# EAGLE design untitled (EAGLE 9.6.2)
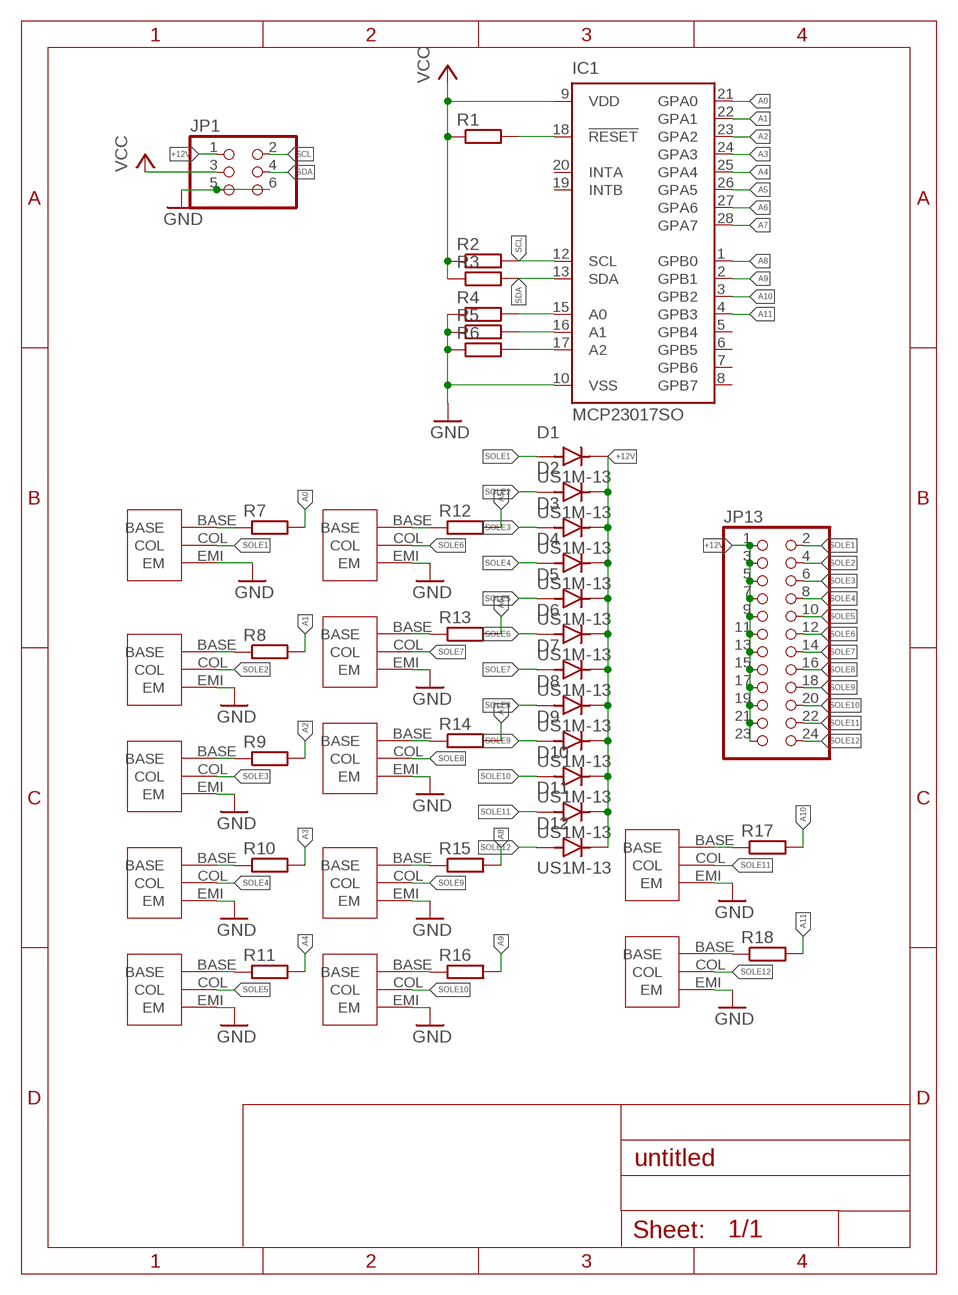
[diagram p0: schematic, sheet 1]

## Parts
BD677-SMD1  BD677-SMD  [BD677-SMD]
BD677-SMD2  BD677-SMD  [BD677-SMD]
BD677-SMD3  BD677-SMD  [BD677-SMD]
BD677-SMD4  BD677-SMD  [BD677-SMD]
BD677-SMD5  BD677-SMD  [BD677-SMD]
BD677-SMD6  BD677-SMD  [BD677-SMD]
BD677-SMD7  BD677-SMD  [BD677-SMD]
BD677-SMD8  BD677-SMD  [BD677-SMD]
BD677-SMD9  BD677-SMD  [BD677-SMD]
BD677-SMD10  BD677-SMD  [BD677-SMD]
BD677-SMD11  BD677-SMD  [BD677-SMD]
BD677-SMD12  BD677-SMD  [BD677-SMD]
D1  US1M-13  [DIOM5226X240N]
D2  US1M-13  [DIOM5226X240N]
D3  US1M-13  [DIOM5226X240N]
D4  US1M-13  [DIOM5226X240N]
D5  US1M-13  [DIOM5226X240N]
D6  US1M-13  [DIOM5226X240N]
D7  US1M-13  [DIOM5226X240N]
D8  US1M-13  [DIOM5226X240N]
D9  US1M-13  [DIOM5226X240N]
D10  US1M-13  [DIOM5226X240N]
D11  US1M-13  [DIOM5226X240N]
D12  US1M-13  [DIOM5226X240N]
IC1  MCP23017SO  [SO28W]
JP1  PINHD-2X3  [2X03]
JP13  PINHD-2X12  [2X12]
R1  R-EU_R0805  [R0805]
R2  R-EU_R0805  [R0805]
R3  R-EU_R0805  [R0805]
R4  R-EU_R0805  [R0805]
R5  R-EU_R0805  [R0805]
R6  R-EU_R0805  [R0805]
R7  R-EU_R0805  [R0805]
R8  R-EU_R0805  [R0805]
R9  R-EU_R0805  [R0805]
R10  R-EU_R0805  [R0805]
R11  R-EU_R0805  [R0805]
R12  R-EU_R0805  [R0805]
R13  R-EU_R0805  [R0805]
R14  R-EU_R0805  [R0805]
R15  R-EU_R0805  [R0805]
R16  R-EU_R0805  [R0805]
R17  R-EU_R0805  [R0805]
R18  R-EU_R0805  [R0805]

## Nets
+12V: D1.C(K) D2.C(K) D3.C(K) D4.C(K) D5.C(K) D6.C(K) D7.C(K) D8.C(K) D9.C(K) D10.C(K) D11.C(K) D12.C(K) JP1.1 JP13.1 JP13.3 JP13.5 JP13.7 JP13.9 JP13.11 JP13.13 JP13.15 JP13.17 JP13.19 JP13.21 JP13.23
A0: IC1.21(GPA0) R7.2
A1: IC1.22(GPA1) R8.2
A2: IC1.23(GPA2) R9.2
A3: IC1.24(GPA3) R10.2
A4: IC1.25(GPA4) R11.2
A5: IC1.26(GPA5) R12.2
A6: IC1.27(GPA6) R13.2
A7: IC1.28(GPA7) R14.2
A8: IC1.1(GPB0) R15.2
A9: IC1.2(GPB1) R16.2
A10: IC1.3(GPB2) R17.2
A11: IC1.4(GPB3) R18.2
GND: BD677-SMD1.EMI(EM) BD677-SMD2.EMI(EM) BD677-SMD3.EMI(EM) BD677-SMD4.EMI(EM) BD677-SMD5.EMI(EM) BD677-SMD6.EMI(EM) BD677-SMD7.EMI(EM) BD677-SMD8.EMI(EM) BD677-SMD9.EMI(EM) BD677-SMD10.EMI(EM) BD677-SMD11.EMI(EM) BD677-SMD12.EMI(EM) IC1.10(VSS) JP1.5 JP1.6 R4.1 R5.1 R6.1
N$1: IC1.18(!RESET) R1.2
N$2: BD677-SMD1.BASE R7.1
N$3: BD677-SMD2.BASE R8.1
N$4: IC1.15(A0) R4.2
N$5: IC1.16(A1) R5.2
N$6: IC1.17(A2) R6.2
N$7: BD677-SMD3.BASE R9.1
N$8: BD677-SMD6.BASE R12.1
N$9: BD677-SMD7.BASE R13.1
N$10: BD677-SMD8.BASE R14.1
N$11: BD677-SMD4.BASE R10.1
N$12: BD677-SMD5.BASE R11.1
N$13: BD677-SMD9.BASE R15.1
N$14: BD677-SMD10.BASE R16.1
N$21: BD677-SMD11.BASE R17.1
N$22: BD677-SMD12.BASE R18.1
SCL: IC1.12(SCL) JP1.2 R2.2
SDA: IC1.13(SDA) JP1.4 R3.2
SOLE1: BD677-SMD1.COL D1.A JP13.2
SOLE2: BD677-SMD2.COL D2.A JP13.4
SOLE3: BD677-SMD3.COL D3.A JP13.6
SOLE4: BD677-SMD4.COL D4.A JP13.8
SOLE5: BD677-SMD5.COL D5.A JP13.10
SOLE6: BD677-SMD6.COL D6.A JP13.12
SOLE7: BD677-SMD7.COL D7.A JP13.14
SOLE8: BD677-SMD8.COL D8.A JP13.16
SOLE9: BD677-SMD9.COL D9.A JP13.18
SOLE10: BD677-SMD10.COL D10.A JP13.20
SOLE11: BD677-SMD11.COL D11.A JP13.22
SOLE12: BD677-SMD12.COL D12.A JP13.24
VCC: IC1.9(VDD) JP1.3 R1.1 R2.1 R3.1
Unconnected: IC1.5(GPB4) IC1.6(GPB5) IC1.7(GPB6) IC1.8(GPB7) IC1.19(INTB) IC1.20(INTA)

## Library data of the parts
BD677-SMD1-BD677-SMD12 = BD677-SMD:BD677-SMD
D1-D12 = US1M-13:US1M-13: Diode, Fast Recovery, 1a, 1kv, Do-214ac-2, Full Reel Check availability <https://pricing.snapeda.com/parts/US1M-13/Diodes%20Incorporated/view-part?ref=eda>; AVAILABILITY: In Stock; DESCRIPTION: Diode Standard 1000 V 1A Surface Mount SMA; MF: Diodes Incorporated; MP: US1M-13; PACKAGE: DO-214AC-214 Diodes Incorporated; PRICE: None; PURCHASE-URL: https://pricing.snapeda.com/search/part/US1M-13/?ref=eda
IC1 = microchip:MCP23017: http://ww1.microchip.com/downloads/en/DeviceDoc/21952a.pdf Source: http://ww1.microchip.com/downloads/en/DeviceDoc/21952a.pdf; MF: MICROCHIP; MPN: MCP23017-E/SO; OC_FARNELL: 1332087; OC_NEWARK: 31K2958
JP1 = pinhead:PINHD-2X3: PIN HEADER
JP13 = pinhead:PINHD-2X12: PIN HEADER
R1-R18 = rcl:R-EU_: RESISTOR, European symbol; SPICEPREFIX: R

## Board
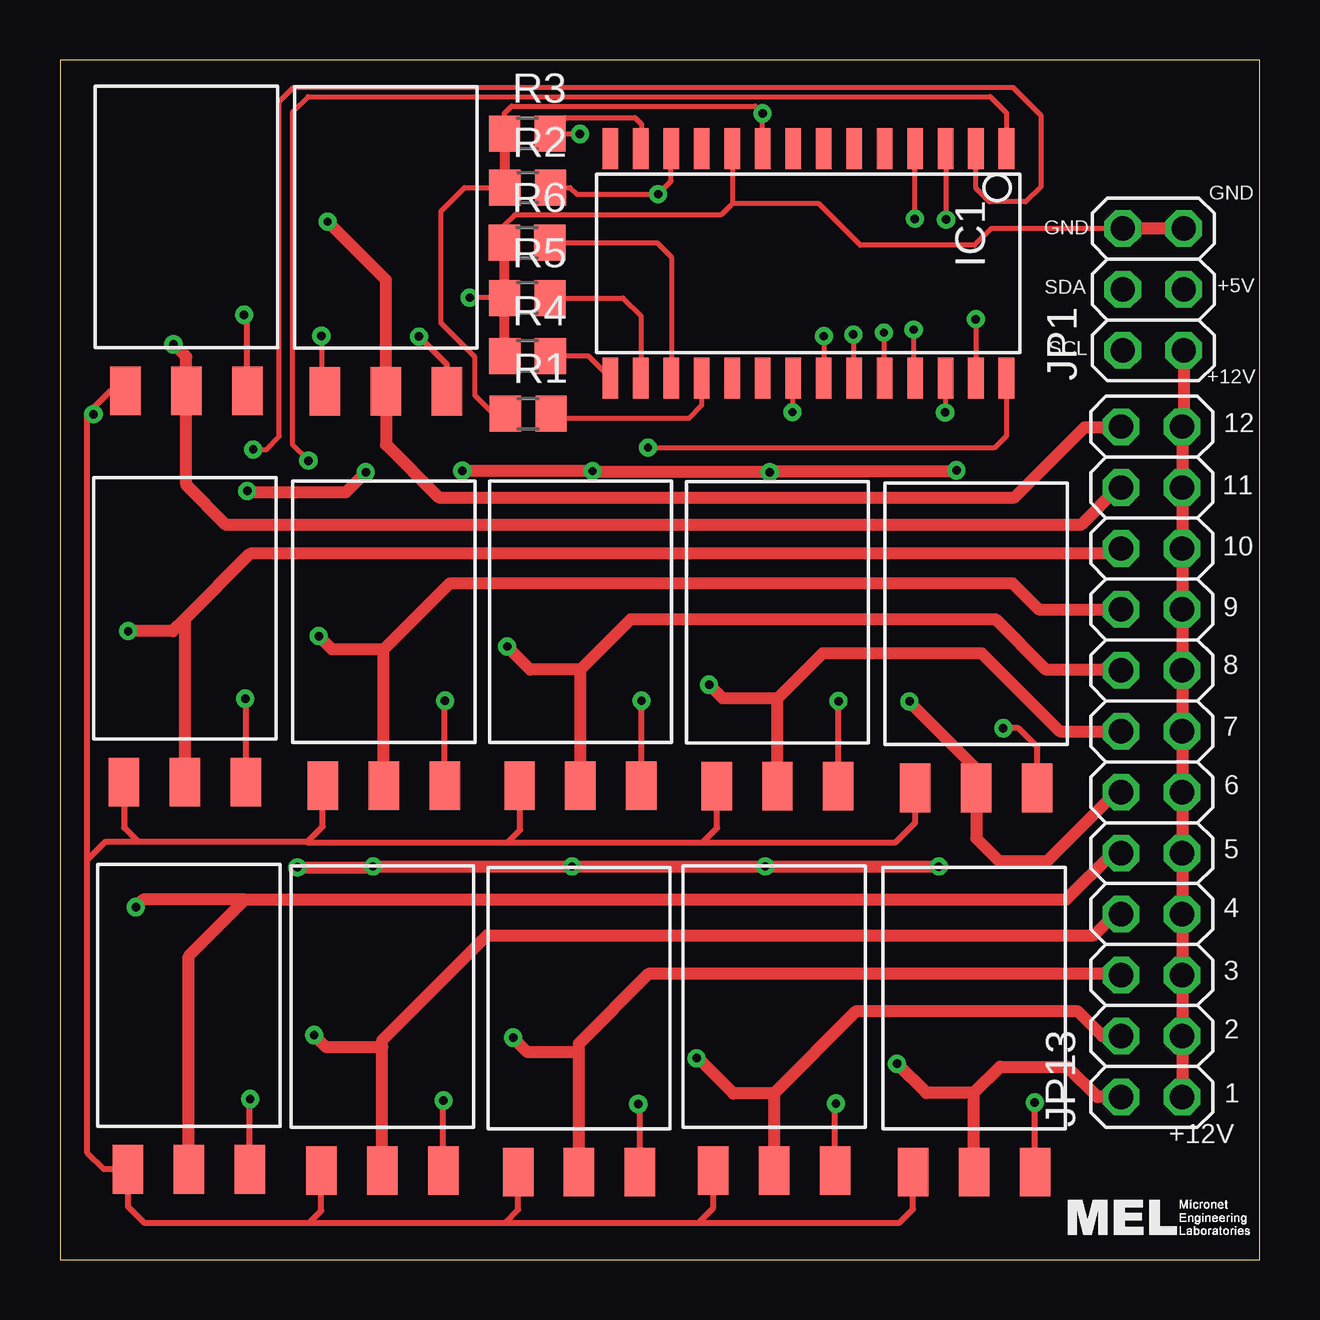
[diagram p1: board, top side]
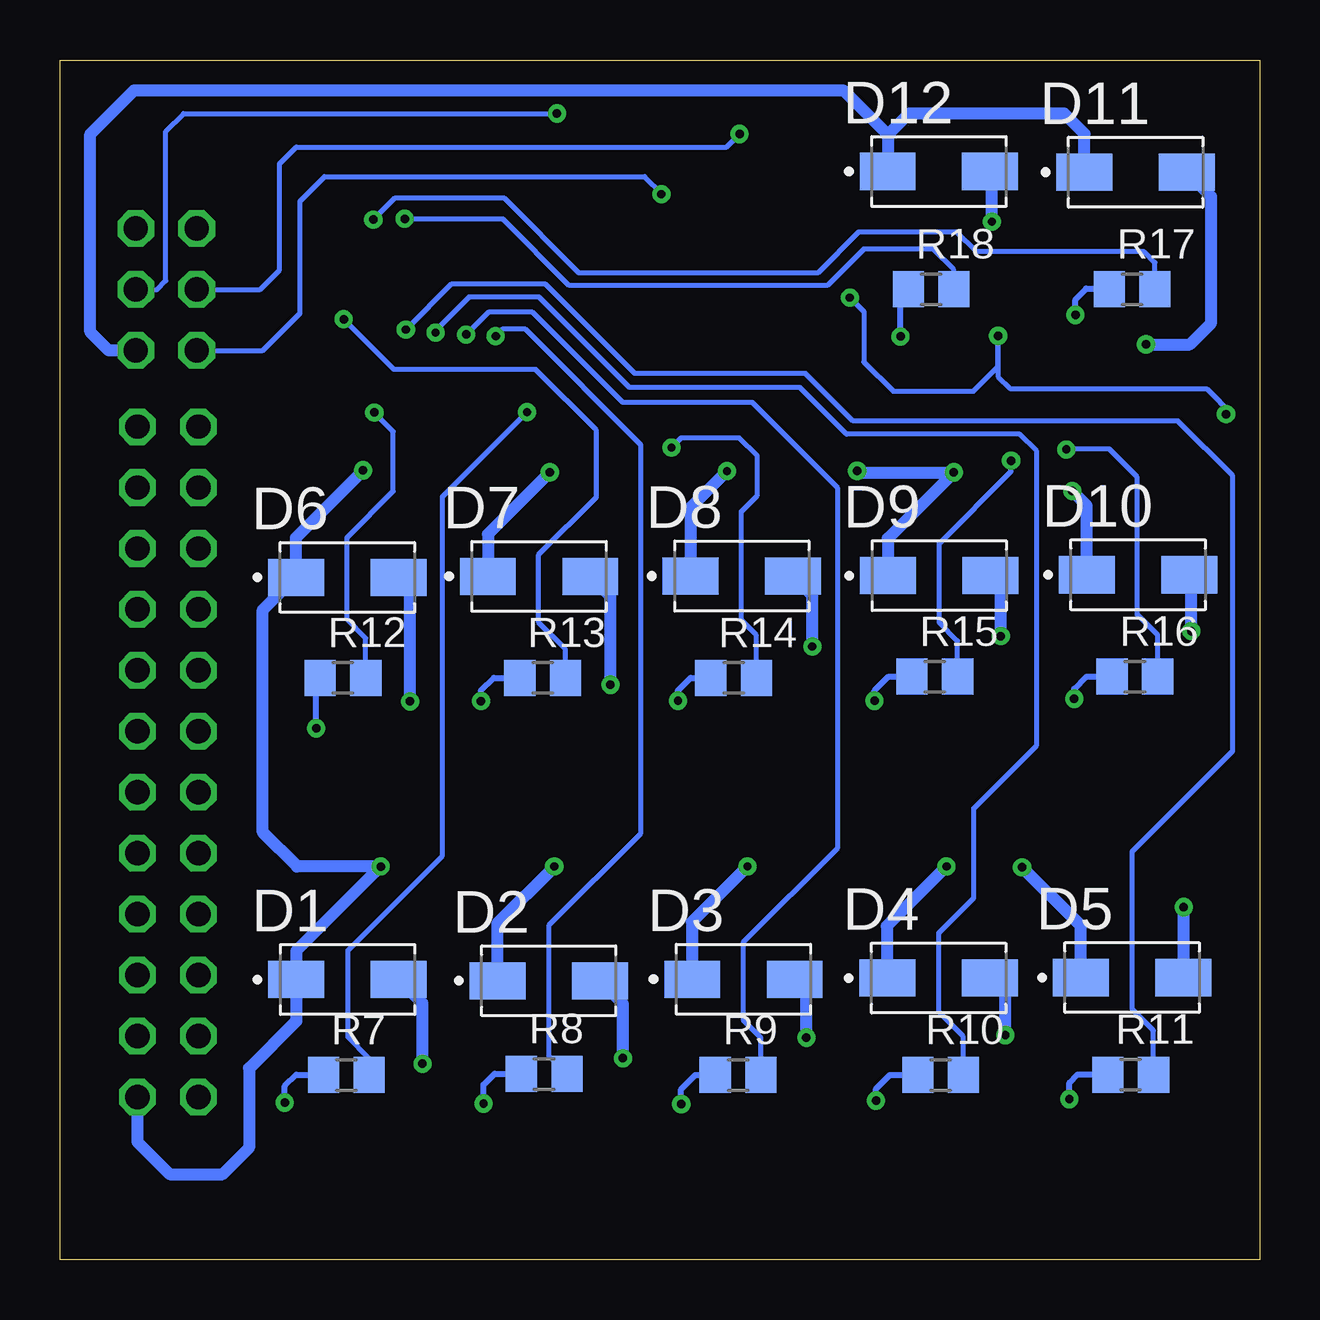
[diagram p2: board, bottom side, seen from below]

Size 50 x 50 mm. Coordinates in mm from the lower left corner, seen from the top.
Outline: 0,0 50,0 50,50 0,50 0,0
Copper layers (1*16): Top 0.035mm / dielectric 1.5mm / Bottom 0.035mm
Design rules "default": minimum track width 6mil, minimum drill 0.35mm, track to track 6mil, track to pad 6mil, pad to pad 6mil, via to via 6mil, smd to smd 6mil, copper to edge 40mil, drill to drill 6mil, minimum pad ring 10mil, minimum via ring 8mil, stop-mask expansion 4mil, vias tented up to drill 0mil, thermal gap 10mil

### Footprints (pad centres in the part's own frame; a part is rotated, then mirrored left to right if it is on the bottom)
BD677-SMD = smd 1.27 x 2.032: BASE 2.54,0; COL 0,0; EMI -2.54,0
DIOM5226X240N = smd 2.33 x 1.55: A 2.135,0; C -2.135,0
SO28W = smd 0.65 x 1.7: 1 -7.62,-4.78; 2 -6.35,-4.78; 3 -5.08,-4.78; 4 -3.81,-4.78; 5 -2.54,-4.78; 6 -1.27,-4.78; 7 0,-4.78; 8 1.27,-4.78; 9 2.54,-4.78; 10 3.81,-4.78; 11 5.08,-4.78; 12 6.35,-4.78; 13 7.62,-4.78; 14 8.89,-4.78; 15 8.89,4.78; 16 7.62,4.78; 17 6.35,4.78; 18 5.08,4.78; 19 3.81,4.78; 20 2.54,4.78; 21 1.27,4.78; 22 0,4.78; 23 -1.27,4.78; 24 -2.54,4.78; 25 -3.81,4.78; 26 -5.08,4.78; 27 -6.35,4.78; 28 -7.62,4.78
2X03 = drill 1.016 octagon: 1 -2.54,-1.27; 2 -2.54,1.27; 3 0,-1.27; 4 0,1.27; 5 2.54,-1.27; 6 2.54,1.27
2X12 = drill 1.016 octagon: 1 -13.97,-1.27; 2 -13.97,1.27; 3 -11.43,-1.27; 4 -11.43,1.27; 5 -8.89,-1.27; 6 -8.89,1.27; 7 -6.35,-1.27; 8 -6.35,1.27; 9 -3.81,-1.27; 10 -3.81,1.27; 11 -1.27,-1.27; 12 -1.27,1.27; 13 1.27,-1.27; 14 1.27,1.27; 15 3.81,-1.27; 16 3.81,1.27; 17 6.35,-1.27; 18 6.35,1.27; 19 8.89,-1.27; 20 8.89,1.27; 21 11.43,-1.27; 22 11.43,1.27; 23 13.97,-1.27; 24 13.97,1.27
R0805 = smd 1.3 x 1.5: 1 -0.95,0; 2 0.95,0

### Placement (x,y rotation side)
BD677-SMD1  38.1,3.64 0 top
BD677-SMD2  29.77,3.7 0 top
BD677-SMD3  21.63,3.64 0 top
BD677-SMD4  13.43,3.7 0 top
BD677-SMD5  5.37,3.76 0 top
BD677-SMD6  38.19,19.66 0 top
BD677-SMD7  29.91,19.73 0 top
BD677-SMD8  21.7,19.75 0 top
BD677-SMD9  13.5,19.75 0 top
BD677-SMD10  5.21,19.9 0 top
BD677-SMD11  5.27,36.21 0 top
BD677-SMD12  13.59,36.19 0 top
D1  38.01,11.67 0 bottom
D2  29.63,11.62 0 bottom
D3  21.51,11.68 0 bottom
D4  13.37,11.74 0 bottom
D5  5.31,11.75 0 bottom
D6  38.02,28.43 0 bottom
D7  30.03,28.47 0 bottom
D8  21.58,28.49 0 bottom
D9  13.35,28.51 0 bottom
D10  5.06,28.54 0 bottom
D11  5.16,45.32 0 bottom
D12  13.37,45.35 0 bottom
IC1  31.83,41.52 180 top
JP1  45.57,40.44 90 top
JP13  45.51,20.75 90 top
R1  19.51,35.26 0 top
R2  19.49,44.68 0 top
R3  19.48,46.93 0 top
R4  19.49,37.66 0 top
R5  19.48,40.07 0 top
R6  19.47,42.38 0 top
R7  38.06,7.69 0 bottom
R8  29.82,7.73 0 bottom
R9  21.73,7.69 0 bottom
R10  13.29,7.7 0 bottom
R11  5.37,7.71 0 bottom
R12  38.2,24.24 0 bottom
R13  29.88,24.25 0 bottom
R14  21.92,24.24 0 bottom
R15  13.54,24.29 0 bottom
R16  5.2,24.3 0 bottom
R17  5.31,40.44 0 bottom
R18  13.69,40.44 0 bottom

### Tracks (layer width: path | path; a pad name or v marks a point on that pad's centre or on a via)
+12V  (via drill 0.35)
  Top 0.508: JP1.1 46.84,34.78 JP13.23 JP13.21 JP13.19 JP13.17 JP13.15 JP13.13 JP13.11 JP13.9 JP13.7 JP13.5 JP13.3 JP13.1 | v9.9,16.35 13.01,16.35 13.07,16.41 13.07,16.4 v13.05,16.39 v21.34,16.39 v29.39,16.39 | 29.41,16.39 v29.39,16.39 | 29.41,16.39 | v29.39,16.39 29.41,16.39 | v29.39,16.39 | v29.39,16.39 36.62,16.39 36.64,16.36 v36.64,16.37 v36.63,16.38 | v37.37,32.89 37.32,32.84 29.61,32.84 v29.58,32.81 22.25,32.81 v22.2,32.87 16.78,32.87 v16.77,32.88 | v7.81,32.03 7.87,31.98 11.91,31.98 v12.74,32.81
  Bottom 0.254: 15.43,45.42 D12.C
  Bottom 0.508: D5.C 7.45,13.9 v9.9,16.35 | v13.05,16.39 15.54,13.9 15.54,11.76 D4.C | v21.34,16.39 23.67,14.07 23.67,11.7 D3.C | v29.39,16.39 31.78,14 D2.C | D10.C 7.2,31.43 v7.81,32.03 | D9.C 15.49,30.06 v12.74,32.81 16.7,32.81 v16.77,32.88 | v22.2,32.87 23.73,31.33 23.73,28.5 D8.C | D7.C 32.16,30.23 v29.58,32.81 | v37.37,32.89 40.18,30.08 40.18,28.45 | 40.18,28.45 D6.C | 40.18,28.45 41.55,27.08 41.55,17.81 40.12,16.38 v36.63,16.38 40.15,12.86 D1.C 40.15,9.95 42.12,7.98 42.12,4.66 43.22,3.56 45.42,3.56 46.78,4.91 JP13.1 | D11.C 7.3,46.92 8.14,47.76 14.62,47.76 15.5,46.88 | 15.5,46.88 15.5,45.49 15.43,45.42 | JP1.1 47.96,37.9 48.73,38.66 48.73,46.91 46.91,48.73 17.35,48.73 15.5,46.88
A0  (via drill 0.35)
  Top 0.203: IC1.21 30.53,36.72 v30.53,35.32
  Bottom 0.203: R7.2 37.12,8.39 38,9.27 38,12.89 34.06,16.83 34.06,31.79 v30.53,35.32
A1  (via drill 0.35)
  Top 0.203: v31.84,38.49 31.84,36.76 IC1.22
  Bottom 0.203: R8.2 29.61,8.47 29.61,13.94 25.79,17.76 25.79,33.96 30.6,38.77 31.56,38.77 v31.84,38.49
A2  (via drill 0.35)
  Top 0.203: IC1.23 33.07,36.77 v33.07,38.56
  Bottom 0.203: R9.2 20.78,9.24 21.51,9.96 21.51,13.23 17.57,17.17 17.57,32.15 21.14,35.72 26.54,35.72 30.31,39.49 32.14,39.49 v33.07,38.56
A3  (via drill 0.35)
  Top 0.203: v34.34,38.64 34.34,36.77 IC1.24
  Bottom 0.203: R10.2 12.34,9.29 13.37,10.32 13.37,13.61 11.91,15.07 11.91,18.8 9.29,21.43 9.29,33.69 10,34.4 17.22,34.4 19.17,36.35 26.27,36.35 30.03,40.12 32.95,40.12 34.39,38.68 v34.34,38.64
A4  (via drill 0.35)
  Top 0.203: v35.58,38.76 35.58,36.8 IC1.25
  Bottom 0.203: R11.2 4.42,9.54 5.31,10.43 5.31,17 1.12,21.19 1.12,32.68 3.4,34.96 16.94,34.96 18.92,36.94 26.04,36.94 29.75,40.65 33.69,40.65 v35.58,38.76
A5  (via drill 0.35)
  Top 0.203: v36.9,35.31 36.91,35.33 IC1.26
  Bottom 0.203: R12.2 37.25,25.9 38.04,26.69 38.04,30.09 36.11,32.02 36.11,34.52 v36.9,35.31
A6  (via drill 0.35)
  Top 0.203: v38.17,39.19 v38.18,39.19 IC1.27
  Bottom 0.203: R13.2 28.93,25.44 30.04,26.55 30.04,29.38 27.65,31.78 27.65,34.57 30.17,37.1 35.17,37.1 36.08,37.1 v38.17,39.19
A7  (via drill 0.35)
  Top 0.203: v24.51,33.84 38.97,33.84 39.47,34.34 39.47,36.73 IC1.28
  Bottom 0.203: R14.2 20.97,26.02 21.6,26.65 21.6,31.18 20.93,31.85 20.93,33.49 21.69,34.25 24.11,34.25 v24.51,33.84
A8  (via drill 0.35)
  Top 0.203: v10.36,33.3 9.71,33.95 9.71,47.85 10.33,48.48 38.77,48.48 39.45,47.8 IC1.1
  Bottom 0.203: R15.2 12.59,25.79 13.35,26.56 13.35,29.85 10.36,32.85 v10.36,33.3
A9  (via drill 0.35)
  Top 0.203: v8.05,33.77 8.61,33.77 9.14,34.3 9.14,48.27 9.74,48.86 39.72,48.86 40.88,47.71 40.88,44.71 40.26,44.09 38.74,44.09 38.18,44.65 IC1.2
  Bottom 0.203: R16.2 4.25,26.04 5.09,26.88 5.09,32.61 6.27,33.78 8.04,33.78 v8.05,33.77
A10  (via drill 0.35)
  Top 0.203: v36.94,43.35 36.94,46.27 IC1.3
  Bottom 0.203: R17.2 4.36,41.56 4.81,42.01 11.81,42.01 12.63,42.83 16.71,42.83 18.41,41.12 28.37,41.12 31.48,44.23 36.05,44.23 v36.94,43.35
A11  (via drill 0.35)
  Top 0.203: v35.63,43.38 IC1.4
  Bottom 0.203: R18.2 12.74,41.25 13.61,42.12 16.5,42.12 18.02,40.6 28.77,40.6 31.54,43.37 35.62,43.37 v35.63,43.38
GND  (via drill 0.35)
  Top 0.203: R6.1 18.52,43.11 18.94,43.53 27.55,43.53 27.94,43.92 28.02,44 | IC1.10 28.04,46.29 28.04,44.02 28.02,44 | R5.1 18.52,40.09 v17.08,40.09 | v10.9,38.5 10.9,36.34 BD677-SMD12.EMI | v1.39,35.24 1.34,35.24 1.24,35.34 | JP1.6 38.82,42.98 38.12,42.28 33.36,42.28 31.64,44 28.02,44
  Top 0.254: 10.39,1.53 3.5,1.53 2.83,2.21 BD677-SMD5.EMI 1.83,3.76 1.14,4.45 1.14,16.66 | BD677-SMD4.EMI 10.89,2.04 10.39,1.53 | 10.39,1.53 18.54,1.53 | BD677-SMD3.EMI 19.09,2.09 18.54,1.53 | 18.54,1.53 26.61,1.53 | BD677-SMD2.EMI 27.23,2.16 26.61,1.53 | 26.61,1.53 34.99,1.53 35.56,2.1 BD677-SMD1.EMI | BD677-SMD10.EMI 2.67,18 3.26,17.42 3.6,17.42 | 3.6,17.42 10.33,17.42 | BD677-SMD9.EMI 10.96,18.05 10.33,17.42 | 10.33,17.42 10.3,17.39 18.67,17.39 | 18.67,17.39 19.18,17.91 19.18,19.72 BD677-SMD8.EMI | 18.67,17.39 26.79,17.39 | 26.79,17.39 27.39,18 27.39,19.7 BD677-SMD7.EMI | 26.79,17.39 34.83,17.39 35.65,18.21 BD677-SMD6.EMI | 1.14,16.66 1.91,17.43 3.59,17.43 3.6,17.42 | 1.14,16.66 1.14,35.24 1.24,35.34 2.12,36.21 BD677-SMD11.EMI
  Top 0.406: R4.1 R5.1 18.53,42.36 R6.1
  Top 0.508: JP1.5 JP1.6
  Bottom 0.203: v17.08,40.09 16.5,39.51 16.5,37.42 15.27,36.19 11.92,36.19 10.9,37.21 v10.9,38.5 10.9,36.81 10.38,36.29 2.21,36.29 1.12,35.2 1.36,35.2 v1.39,35.24
N$1
  Top 0.2: R1.2 20.66,35.06 26.21,35.06 26.76,35.61 IC1.18
N$2  (via drill 0.35)
  Top 0.254: BD677-SMD1.BASE v40.64,6.54 v40.63,6.54
  Bottom 0.254: v40.63,6.54 40.63,7.23 40.16,7.71 39.03,7.71 R7.1
N$3  (via drill 0.35)
  Top 0.254: BD677-SMD2.BASE 32.31,6.47 v32.34,6.5
  Bottom 0.254: v32.34,6.5 32.34,7.28 31.89,7.74 30.78,7.74 R8.1
N$4
  Top 0.2: IC1.15 22.02,37.66 R4.2
N$5
  Top 0.2: R5.2 23.47,40.07 24.21,39.33 IC1.16
N$6
  Top 0.2: R6.2 24.89,42.38 25.48,41.79 IC1.17
N$7  (via drill 0.35)
  Top 0.254: BD677-SMD3.BASE 24.17,6.49 24.15,6.52 v24.11,6.48
  Bottom 0.254: v24.11,6.48 24.11,7.1 23.51,7.69 R9.1
N$8  (via drill 0.35)
  Top 0.254: BD677-SMD6.BASE 40.73,21.36 39.94,22.15 v39.32,22.15
  Bottom 0.254: v39.32,22.15 39.32,24.24 R12.1
N$9  (via drill 0.35)
  Top 0.254: BD677-SMD7.BASE v32.45,23.27 v32.45,23.28
  Bottom 0.254: v32.45,23.28 32.45,23.71 31.91,24.25 R13.1
N$10  (via drill 0.35)
  Top 0.254: BD677-SMD8.BASE v24.24,23.29
  Bottom 0.254: v24.24,23.29 24.24,23.71 23.71,24.24 R14.1
N$11  (via drill 0.35)
  Top 0.254: BD677-SMD4.BASE 15.97,6.61 v15.99,6.63
  Bottom 0.254: v15.99,6.63 15.99,7.12 15.41,7.7 R10.1
N$12  (via drill 0.35)
  Top 0.254: BD677-SMD5.BASE 7.91,6.67 v7.93,6.68
  Bottom 0.254: v7.93,6.68 7.93,7.37 7.58,7.71 R11.1
N$13  (via drill 0.35)
  Top 0.254: BD677-SMD9.BASE v16.04,23.28 v16.05,23.29
  Bottom 0.254: v16.05,23.29 16.05,23.71 15.46,24.29 R15.1
N$14  (via drill 0.35)
  Top 0.254: BD677-SMD10.BASE 7.75,23.28 7.69,23.34 | 7.69,23.34 | 7.69,23.34 v7.73,23.37
  Bottom 0.254: v7.73,23.37 7.73,23.79 7.21,24.3 R16.1
N$21  (via drill 0.35)
  Top 0.254: BD677-SMD11.BASE 7.81,39.31 7.72,39.4 7.7,39.4 v7.67,39.38
  Bottom 0.254: R17.1 6.29,40.47 7.22,40.47 7.67,40.02 v7.67,39.38
N$22  (via drill 0.35)
  Top 0.254: BD677-SMD12.BASE 16.13,37.31 v14.96,38.47
  Bottom 0.254: v14.96,38.47 14.96,40.44 R18.1
SCL  (via drill 0.35)
  Top 0.2: R2.2 21.27,44.68 21.54,44.4 v24.93,44.4 25.48,44.95 IC1.12
  Bottom 0.203: JP1.2 41.55,37.9 40,39.44 40,44.11 38.97,45.14 25.63,45.14 24.91,44.43 24.91,44.42 v24.93,44.4
SDA  (via drill 0.35)
  Top 0.2: R3.2 20.62,47.12 21.09,47.59 23.97,47.59 24.24,47.32 24.24,46.34 IC1.13
  Top 0.203: v21.67,46.91 20.83,46.91 20.62,47.12
  Bottom 0.203: JP1.4 41.66,40.44 40.85,41.24 40.85,45.67 40.16,46.37 22.22,46.37 v21.67,46.91
SOLE1  (via drill 0.35)
  Top 0.508: BD677-SMD1.COL 38.1,6.95 | 38.1,6.95 39.19,8.04 42,8.04 43.26,6.78 JP13.2 | 38.1,6.95 36.11,6.95 v34.89,8.16
  Bottom 0.508: v34.89,8.16 34.89,10.69 D1.A
SOLE2  (via drill 0.35)
  Top 0.508: BD677-SMD2.COL 29.77,6.92 | 29.77,6.92 33.2,10.36 42.4,10.36 43.44,9.32 JP13.4 | 29.77,6.92 28.07,6.92 26.57,8.43 v26.54,8.39
  Bottom 0.508: v26.54,8.39 26.54,10.66 D2.A
SOLE3  (via drill 0.35)
  Top 0.508: BD677-SMD3.COL 21.63,8.64 | 21.63,8.64 21.63,9 24.56,11.92 44.17,11.92 JP13.6 | 21.63,8.64 19.5,8.64 v18.89,9.25
  Bottom 0.508: v18.89,9.25 18.89,11.2 D3.A
SOLE4  (via drill 0.35)
  Top 0.508: BD677-SMD4.COL 13.44,8.85 | 13.44,8.85 13.44,9.14 17.8,13.51 43.1,13.51 43.98,14.4 JP13.8 | 13.44,8.85 11.1,8.85 v10.6,9.35
  Bottom 0.508: v10.6,9.35 10.6,11.09 D4.A
SOLE5  (via drill 0.35)
  Top 0.508: BD677-SMD5.COL 5.37,12.65 7.73,15 | 7.73,15 41.95,15 43.88,16.94 JP13.10 | 7.73,15 3.48,15 v3.16,14.69
  Bottom 0.508: v3.16,14.69 3.18,14.68 D5.A
SOLE6  (via drill 0.35)
  Top 0.508: JP13.12 44.02,19.48 41.16,16.62 39.13,16.62 38.19,17.55 BD677-SMD6.COL 38.19,20.45 35.4,23.25 v35.41,23.27
  Bottom 0.508: v35.41,23.27 35.41,27.96 D6.A
SOLE7  (via drill 0.35)
  Top 0.508: BD677-SMD7.COL 29.91,23.39 | 29.91,23.39 31.8,25.28 38.42,25.28 41.68,22.02 JP13.14 | 29.91,23.39 27.63,23.39 v27.06,23.96
  Bottom 0.508: v27.06,23.96 27.06,27.64 D7.A
SOLE8  (via drill 0.35)
  Top 0.508: BD677-SMD8.COL 21.7,24.59 | 21.7,24.59 23.8,26.69 38.99,26.69 41.08,24.6 44.19,24.6 JP13.16 | 21.7,24.59 19.6,24.59 v18.64,25.55
  Bottom 0.508: v18.64,25.55 18.64,27.68 D8.A
SOLE9  (via drill 0.35)
  Top 0.508: BD677-SMD9.COL 13.5,25.43 | 13.5,25.43 16.26,28.2 39.7,28.2 40.8,27.1 JP13.18 | 13.5,25.43 11.34,25.43 v10.79,25.98
  Bottom 0.508: v10.79,25.98 10.79,28.07 D9.A
SOLE10  (via drill 0.35)
  Top 0.508: BD677-SMD10.COL 5.21,26.7 | JP13.20 44.02,29.42 7.93,29.42 5.21,26.7 | 5.21,26.7 4.7,26.19 v2.84,26.19
  Bottom 0.508: v2.84,26.19 2.84,28.46 D10.A
SOLE11  (via drill 0.35)
  Top 0.508: JP13.22 44.1,32.18 42.55,30.62 6.94,30.62 5.27,32.29 BD677-SMD11.COL 5.27,37.63 4.75,38.14 v4.73,38.14
  Bottom 0.254: 2.69,44.99 D11.A
  Bottom 0.508: v4.73,38.14 2.91,38.14 2.02,39.04 2.02,44.31 2.69,44.99
SOLE12  (via drill 0.35)
  Top 0.508: 44.33,34.7 44.36,34.67 | JP13.24 44.22,34.7 42.71,34.7 39.78,31.77 15.78,31.77 13.59,33.96 BD677-SMD12.COL 13.59,40.83 v11.15,43.26
  Bottom 0.508: v11.15,43.26 11.15,45.27 D12.A
VCC  (via drill 0.35)
  Top 0.203: R3.1 18.53,47.78 18.83,48.08 28.98,48.08 v29.29,47.77 29.27,47.75 29.27,46.33 IC1.9 | R1.1 18.06,35.26 17.3,36.02 17.3,37.61 15.88,39.03 15.88,43.69 16.86,44.68 R2.1
  Top 0.406: R2.1 18.54,46.92 R3.1
  Bottom 0.203: v29.29,47.77 44.85,47.77 45.59,47.03 45.59,40.8 45.95,40.44 JP1.3

### Text on the board
tPlace: GND | GND | SDA | +5V | SCL | +12V | 12 | 11 | 10 | 9 | 8 | 7 | 6 | 5 | 4 | 3 | 2 | 1 | +12V